# EAGLE design ArduinoBase (EAGLE 9.3.0)
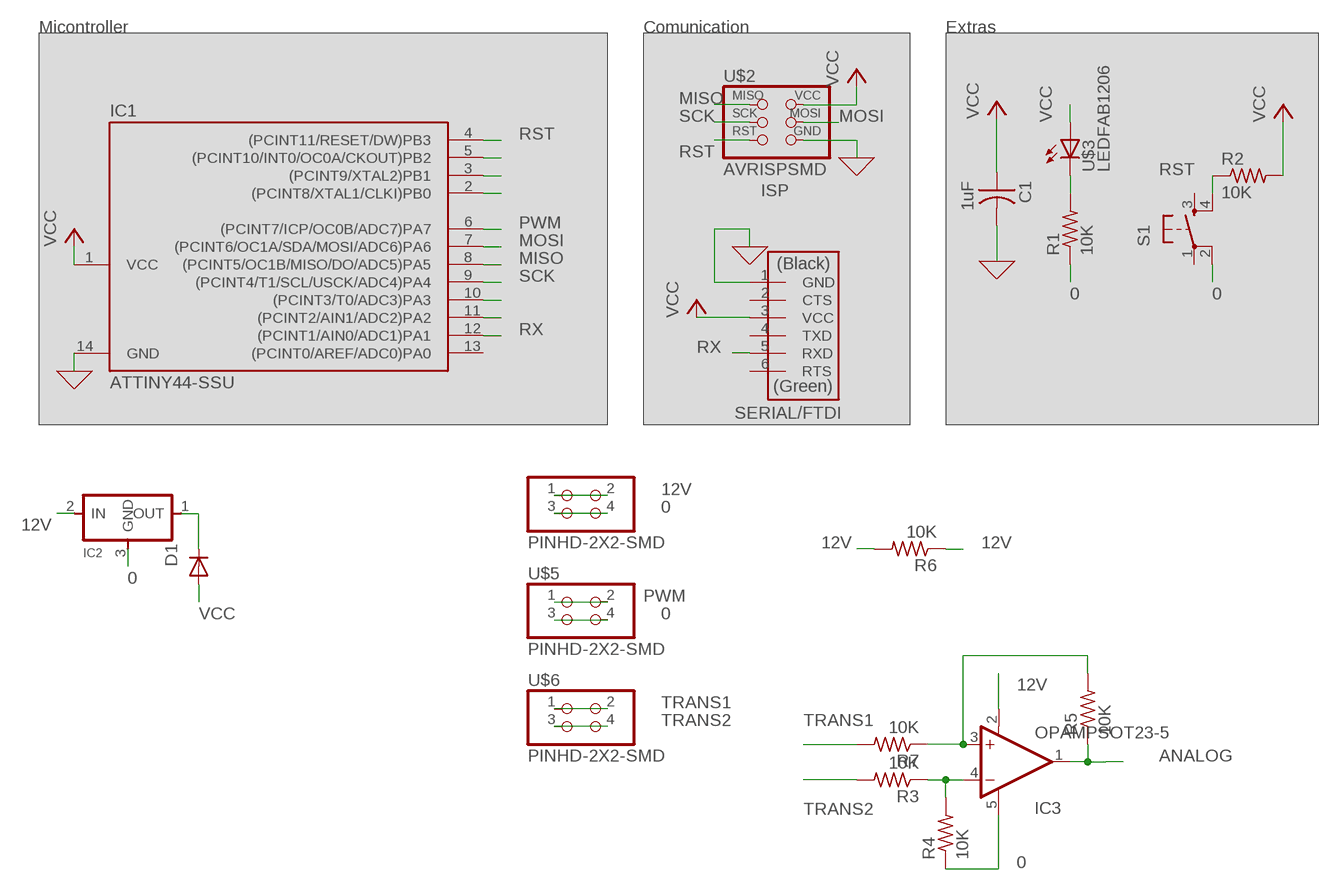
[diagram p0: schematic, sheet 1]

## Parts
C1  1uF  CAP-US1206FAB  [C1206FAB]
D1  DIODESOD123  [SOD123]
GND  PINHD-2X2-SMD  [2X02SMD]
IC1  ATTINY44-SSU  [SOIC14]
IC2  REGULATORSOT23  [SOT23]
IC3  OPAMPSOT23-5  [SOT23-5]
R1  10K  RES-US1206FAB  [R1206FAB]
R2  10K  RES-US1206FAB  [R1206FAB]
R3  10K  RES-US1206FAB  [R1206FAB]
R4  10K  RES-US1206FAB  [R1206FAB]
R5  10K  RES-US1206FAB  [R1206FAB]
R6  10K  RES-US1206FAB  [R1206FAB]
R7  10K  RES-US1206FAB  [R1206FAB]
S1  6MM_SWITCH6MM_SWITCH  [6MM_SWITCH]
U$1  FTDI-SMD-HEADER  [1X06SMD]
U$2  AVRISPSMD  [2X03SMD]
U$3  LEDFAB1206  [LED1206FAB]
U$5  PINHD-2X2-SMD  [2X02SMD]
U$6  PINHD-2X2-SMD  [2X02SMD]

## Nets
0: C1.2 GND.3 GND.4 IC1.14(GND) IC2.3(GND) IC3.5(V+) R1.1 R4.1 S1.2(P1) U$1.1(GND) U$2.6(GND) U$5.3 U$5.4 ; supply symbol labelled GND
12V: GND.1 GND.2 IC2.2(IN) IC3.2(V-) R6.1 R6.2
ANALOG: IC3.1(OUT) R5.1
MISO: IC1.8((PCINT5/OC1B/MISO/DO/ADC5)PA5) U$2.1(MISO)
MOSI: IC1.7((PCINT6/OC1A/SDA/MOSI/ADC6)PA6) U$2.4(MOSI)
N$1: R1.2 U$3.2(C)
N$3: IC3.3(+IN) R5.2 R7.1
N$5: IC1.5((PCINT10/INT0/OC0A/CKOUT)PB2)
N$6: IC1.3((PCINT9/XTAL2)PB1)
N$7: IC1.2((PCINT8/XTAL1/CLKI)PB0)
N$9: D1.CATHODE(C) IC2.1(OUT)
N$11: IC3.4(-IN) R3.1 R4.2
N$12: IC1.10((PCINT3/T0/ADC3)PA3)
N$13: IC1.11((PCINT2/AIN1/ADC2)PA2)
PWM: IC1.6((PCINT7/ICP/OC0B/ADC7)PA7) U$5.1 U$5.2
RST: IC1.4((PCINT11/RESET/DW)PB3) R2.1 S1.4(S1) U$2.5(RST)
RX: IC1.12((PCINT1/AIN0/ADC1)PA1) U$1.5(RXD)
SCK: IC1.9((PCINT4/T1/SCL/USCK/ADC4)PA4) U$2.3(SCK)
TRANS1: R7.2 U$6.1 U$6.2
TRANS2: R3.2 U$6.3 U$6.4
VCC: C1.1 D1.ANODE(A) IC1.1(VCC) R2.2 U$1.3(VCC) U$2.2(VCC) U$3.1(A)
Unconnected: IC1.13((PCINT0/AREF/ADC0)PA0) S1.1(P) S1.3(S) U$1.2(CTS) U$1.4(TXD) U$1.6(RTS)

## Notes on the sheet
- Micontroller | Comunication | Extras
- ISP
- SERIAL/FTDI

## Library data of the parts
C1 = fab:CAP-US
D1 = fab:DIODE: DIODE high speed (Philips)
GND U$5 U$6 = fab:PINHD-2X2-SMD
IC1 = fab:ATTINY44
IC2 = fab:REGULATOR
IC3 = fab:OPAMP: Rail-to-Rail Operational Amplifiers Single-Supply, MicroAmplifier(TM) Series
R1-R7 = fab:RES-US: Resistor (US Symbol) Variants with postfix FAB are widened to allow the routing of internal traces
S1 = fab:6MM_SWITCH: OMRON SWITCH
U$1 = fab:FTDI-SMD-HEADER
U$2 = fab:AVRISP
U$3 = fab:LED: LED

## Board
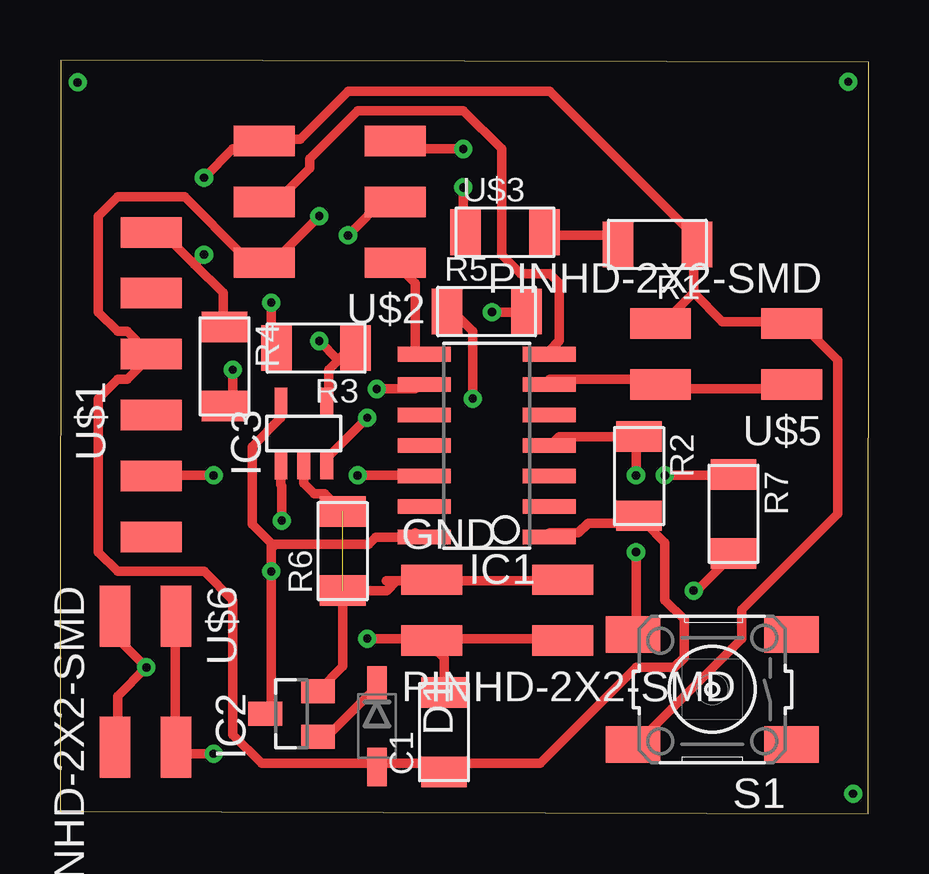
[diagram p1: board, top side]
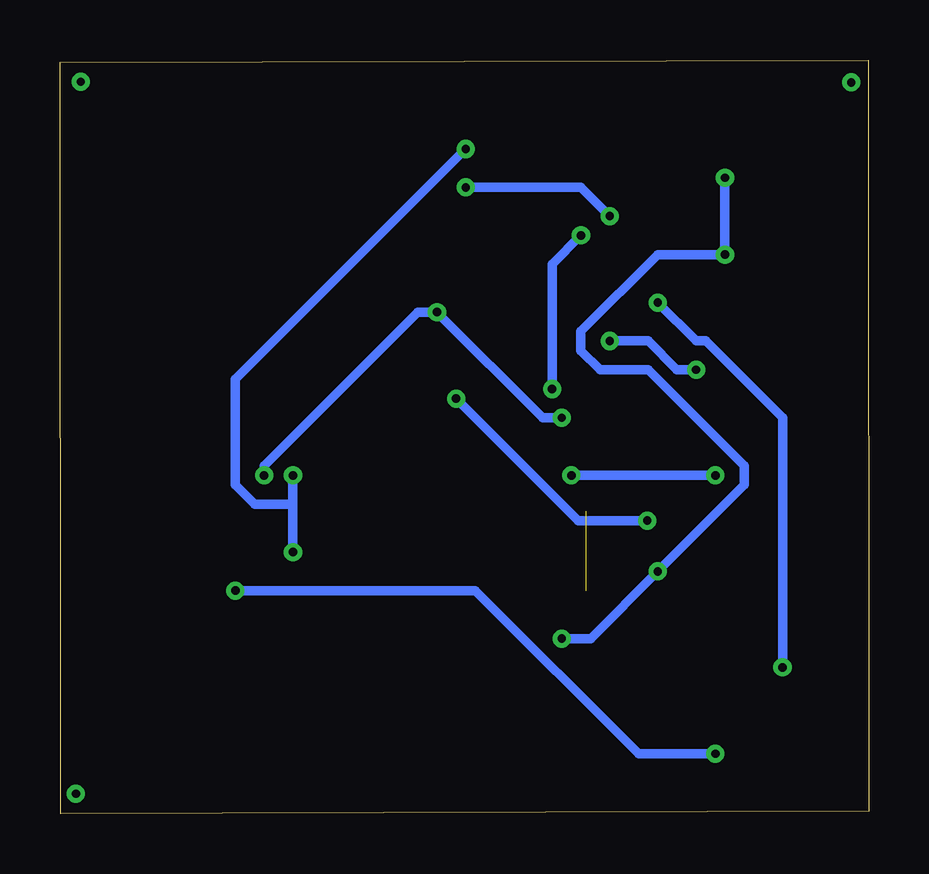
[diagram p2: board, bottom side, seen from below]

Size 33.71 x 31.41 mm. Coordinates in mm from the lower left corner, seen from the top.
Outline: 0,0.1 33.68,0 33.71,31.31 0.03,31.41 0,0.1
Copper layers (1*16): Top 0.035mm / dielectric 1.5mm / Bottom 0.035mm
Design rules "default *": minimum track width 0.4mm, minimum drill 0.35mm, track to track 0.4mm, track to pad 0.4mm, pad to pad 0.4mm, via to via 0.4mm, smd to smd 0.4mm, copper to edge 40mil, drill to drill 6mil, minimum pad ring 10mil, minimum via ring 8mil, stop-mask expansion 4mil, vias tented up to drill 0mil, thermal gap 10mil

### Footprints (pad centres in the part's own frame; a part is rotated, then mirrored left to right if it is on the bottom)
C1206FAB = smd 1.27 x 1.905: 1 -1.651,0; 2 1.651,0
SOD123 = smd 1.6 x 0.8: ANODE 1.7,0; CATHODE -1.7,0
2X02SMD = smd 2.54 x 1.27: 1 -2.54,1.27; 2 2.92,1.27; 3 -2.54,-1.27; 4 2.92,-1.27
SOIC14 = smd 0.61 x 2.21: 1 -3.81,-2.603; 2 -2.54,-2.603; 3 -1.27,-2.603; 4 0,-2.603; 5 1.27,-2.603; 6 2.54,-2.603; 7 3.81,-2.603; 8 3.81,2.603; 9 2.54,2.603; 10 1.27,2.603; 11 0,2.603; 12 -1.27,2.603; 13 -2.54,2.603; 14 -3.81,2.603
SOT23 = smd 1 x 1.4: 1 -0.95,-1.1; 2 0.95,-1.1; 3 0,1.1
SOT23-5 = smd 0.533 x 1.194: 1 -0.95,-1.306; 2 0,-1.306; 3 0.95,-1.306; 4 0.95,1.306; 5 -0.95,1.306
R1206FAB = smd 1.27 x 1.905: 1 -1.651,0; 2 1.651,0
6MM_SWITCH = smd 2.286 x 1.524: 1 -3.302,2.286; 2 3.302,2.286; 3 -3.302,-2.286; 4 3.302,-2.286
1X06SMD = smd 2.54 x 1.27: 1 0,6.35; 2 0,3.81; 3 0,1.27; 4 0,-1.27; 5 0,-3.81; 6 0,-6.35
2X03SMD = smd 2.54 x 1.27: 1 -2.54,2.54; 2 2.92,2.54; 3 -2.54,0; 4 2.92,0; 5 -2.54,-2.54; 6 2.92,-2.54
LED1206FAB = smd 1.27 x 1.905: 1 -1.651,0; 2 1.651,0

### Placement (x,y rotation side)
C1  16,3.4 90 top
D1  13.21,3.66 270 top
GND  18.03,8.48 0 top
IC1  17.78,15.34 90 top
IC2  9.65,4.17 90 top
IC3  10.16,15.85 0 top
R1  24.89,23.72 180 top
R2  24.13,14.07 270 top
R3  10.67,19.41 180 top
R4  6.86,18.64 270 top
R5  17.78,20.93 0 top
R6  11.79,10.95 90 top
R7  28.07,12.5 270 top
S1  27.18,5.18 180 top
U$1  3.81,17.88 0 top
U$2  11.43,25.5 180 top
U$3  18.54,24.23 0 top
U$5  27.94,19.15 180 top
U$6  3.56,5.69 270 top

### Tracks (layer width: path | path; a pad name or v marks a point on that pad's centre or on a via)
0  (via drill 0.35)
  Top 0.4: S1.2 24,2.9 28.4,7.3 28.4,8.5 32.4,12.5 32.4,18.9 30.8,20.5 U$5.3 30.4,20.5 27.6,20.5 26.4,21.7 | IC3.5 9.2,16.9 9.2,16.5 8,15.3 8,12.07 8.8,11.27 8.8,11.05 | 14.8,11.7 IC1.14 13.15,11.53 12.86,11.24 8.99,11.24 8.8,11.05 | IC2.3 8.8,4.5 v8.8,10.1 8.8,11.05 | C1.2 16,5.3 16,6.5 15.6,6.9 GND.3 | GND.4 20.8,7.3 15.6,7.3 GND.3 | 5.6,22.9 4,24.5 U$1.1 | 5.6,22.9 6.8,21.7 6.8,20.5 R4.1 | 26.4,21.7 26.4,23.7 R1.1 26.4,24.1 20.4,30.1 12,30.1 10,28.1 8.8,28.1 U$2.6 8.4,27.7 7.2,27.7 v6,26.5 | 26.4,21.7 25.2,20.5 U$5.4 | v6,23.3 5.6,22.9 | v12.8,7.3 15.2,7.3 GND.3
  Bottom 0.4: v6,26.5 v6,23.3 8.8,23.3 12,20.1 12,19.3 11.2,18.5 9.2,18.5 5.2,14.5 5.2,13.7 v8.8,10.1 11.6,7.3 v12.8,7.3
12V  (1 unrouted)
  Top 0.4: 14.02,9.7 15.2,9.7 GND.1 15.6,9.7 20.8,9.7 GND.2 | 14.02,9.7 13.6,9.7 | 10.8,5.3 IC2.2 11.79,6.15 R6.1 13.62,9.3 14.02,9.7 | R6.2 11.04,13.35 10.6,13.35 10.16,13.78 IC3.2
ANALOG  (via drill 0.35)
  Top 0.4: v17.2,17.3 17.2,20.1 16.4,20.9 R5.1 | IC3.1 9.2,14.5 9.2,13.7 9.24,13.66 v9.24,12.22
  Bottom 0.4: v9.24,12.22 12.11,12.22 v17.2,17.3
MISO
  Top 0.4: IC1.8 14.8,19.3 14.8,22.1 14,22.9 U$2.1
MOSI
  Top 0.4: IC1.7 20.4,19.3 20.8,19.7 20.8,22.1 20.4,22.5 19.2,22.5 18.4,23.3 18.4,27.7 16.8,29.3 12.4,29.3 10.4,27.3 10.4,26.9 8.8,25.3 U$2.4
N$1
  Top 0.4: R1.2 23.2,24.1 20.4,24.1 U$3.2
N$2  (via drill 0.35)
  other vias: 32.84,30.51
N$3  (via drill 0.35)
  Top 0.4: v12.8,16.5 11.2,14.9 IC3.3 | v18,20.9 19.2,20.9 R5.2 | v25.2,14.1 28.02,14.1 R7.1
  Bottom 0.4: v12.8,16.5 13.6,16.5 v18,20.9 18.8,20.9 25.2,14.5 v25.2,14.1
N$4  (via drill 0.35)
  other vias: 0.74,30.48
N$8  (via drill 0.35)
  other vias: 33.05,0.84
N$9
  Top 0.4: IC2.1 10.8,3.3 11.2,3.3 13.2,5.3 D1.CATHODE
N$11  (via drill 0.35)
  Top 0.4: 11.6,18.9 12,19.3 R3.1 | 11.6,18.9 11.2,18.5 11.2,17.3 IC3.4 | v7.2,18.5 7.2,17.3 R4.2 | 11.6,18.9 v10.8,19.7
  Bottom 0.4: v7.2,18.5 8,18.5 9.2,19.7 v10.8,19.7
PWM
  Top 0.4: IC1.6 20.4,18.1 24.8,18.1 U$5.2 25.2,17.7 30.4,17.7 U$5.1
RST  (via drill 0.35)
  Top 0.4: 24,15.7 20.8,15.7 20.4,15.3 IC1.4 | v24,10.9 24,7.7 S1.4 | 24,15.7 v24,14.1 | 24,15.7 R2.1 | v16.8,27.7 14,27.7 U$2.5
  Bottom 0.4: v24,14.1 24,12.9 | 24,12.9 v24,10.9 | v16.8,27.7 26.4,18.1 26.4,13.7 25.6,12.9 24,12.9
RX  (via drill 0.35)
  Top 0.4: v12.4,14.1 14.8,14.1 IC1.12 | v6.4,14.1 4,14.1 U$1.5
  Bottom 0.4: v6.4,14.1 v12.4,14.1
SCK  (via drill 0.35)
  Top 0.4: v13.2,17.7 14.8,17.7 IC1.9 | v12,24.1 13.6,25.7 U$2.3
  Bottom 0.4: v13.2,17.7 13.2,22.9 v12,24.1
TRANS1  (via drill 0.35)
  Top 0.4: v6.4,2.5 5.2,2.5 U$6.2 4.8,2.9 4.8,8.1 U$6.1 | v26.4,9.3 26.52,9.3 R7.2
  Bottom 0.4: v26.4,9.3 16.4,9.3 9.6,2.5 v6.4,2.5
TRANS2  (via drill 0.35)
  Top 0.4: v8.8,21.3 8.8,19.7 R3.2 | U$6.3 2.4,8.1 2.4,7.3 v3.6,6.1 2.4,4.9 2.4,2.9 U$6.4
  Bottom 0.4: v8.8,21.3 7.2,19.7 6.8,19.7 3.6,16.5 v3.6,6.1
VCC  (via drill 0.35)
  Top 0.4: v16.8,26.1 16.8,24.5 U$3.1 | v10.8,24.9 8.8,22.9 U$2.2 8.4,23.3 7.6,23.3 5.2,25.7 2.4,25.7 1.6,24.9 1.6,20.9 2.4,20.1 2.8,20.1 3.6,19.3 U$1.3 3.6,18.9 2.8,18.1 2.4,18.1 1.6,17.3 1.6,10.9 2.4,10.1 6,10.1 7.2,8.9 7.2,3.3 8.4,2.1 13.2,2.1 D1.ANODE 13.6,2.1 16,2.1 C1.1 16.4,2.1 20,2.1 24,6.1 25.6,6.1 26,6.5 26,8.1 25.2,8.9 25.2,11.3 24.4,12.1 R2.2 24,12.1 22,12.1 21.6,11.7 20.4,11.7 IC1.1
  Bottom 0.4: v16.8,26.1 12,26.1 v10.8,24.9